# EAGLE design xr2206 - FGG6 (EAGLE 9.6.0)
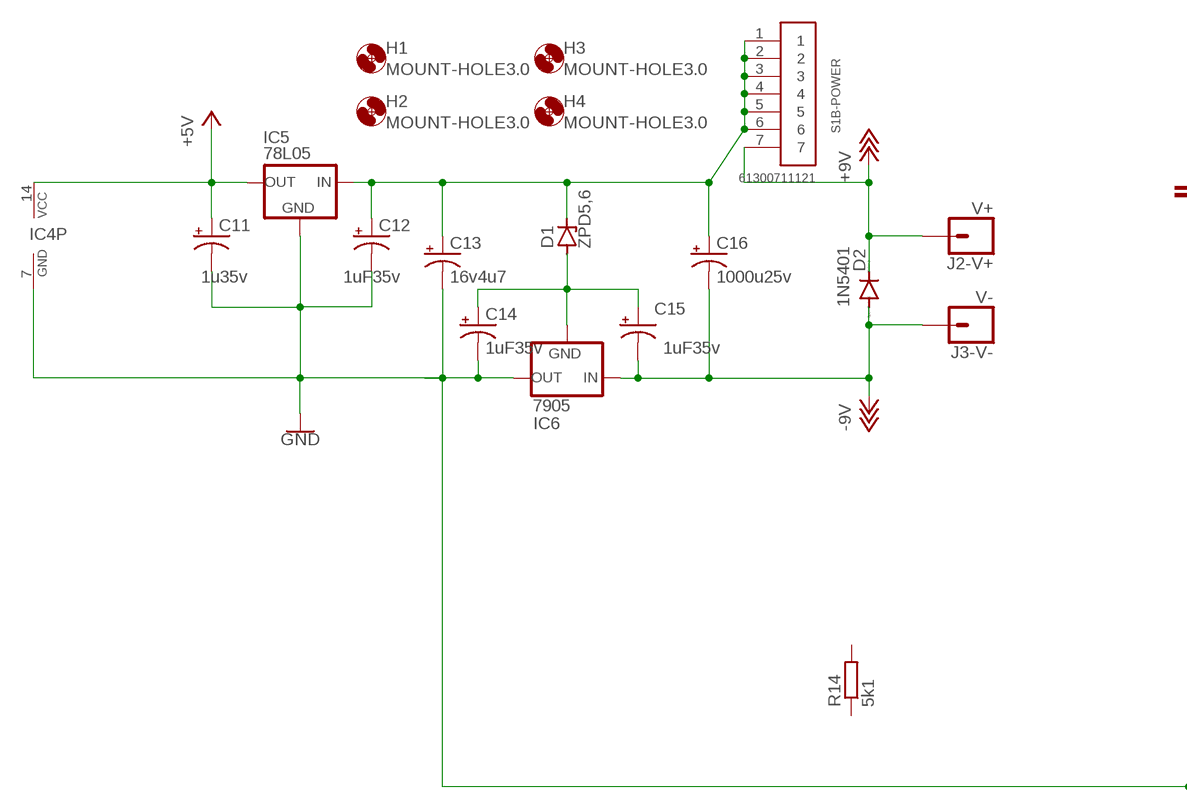
[diagram p0: schematic, sheet 1, part 1 of 2]
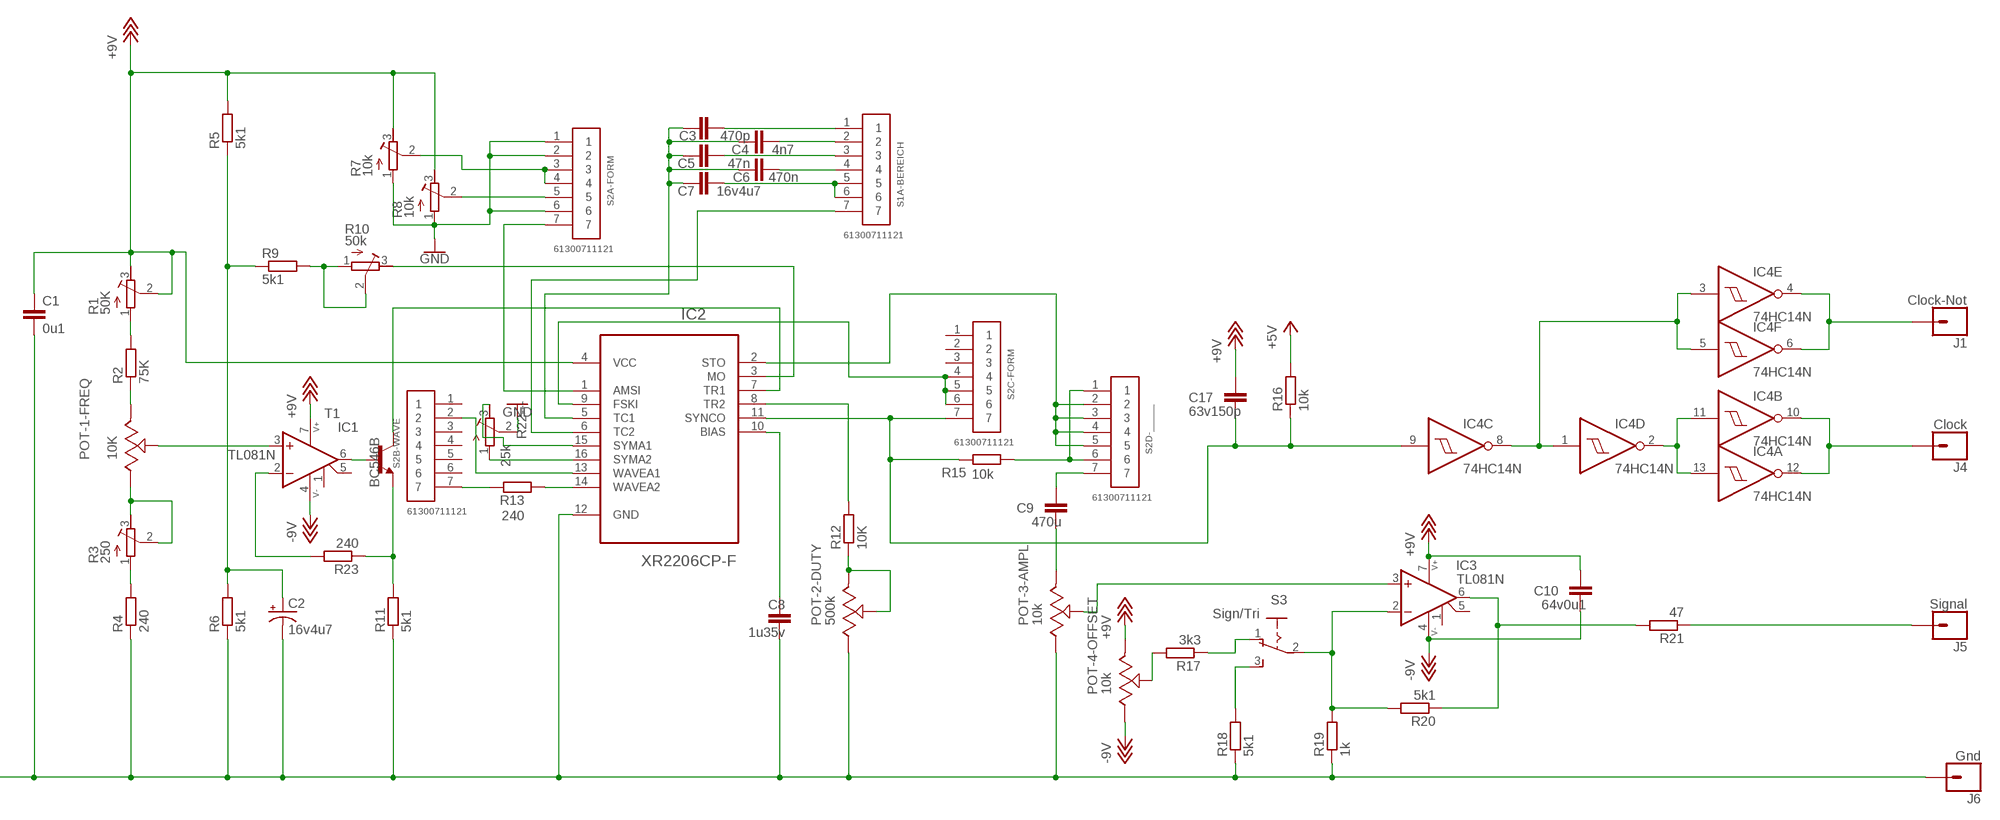
[diagram p1: schematic, sheet 1, part 2 of 2]

## Parts
C1  0u1  10NF-PTH-10MM-10000V-1-%  [CAP-PTH-10MM]
C2  16v4u7  1000UF-RADIAL-5MM-35V-20%-KIT  [CPOL-RADIAL-5MM-10MM-KIT]
C3  470p  10NF-PTH-10MM-10000V-1-%  [CAP-PTH-10MM]
C4  4n7  10NF-PTH-10MM-10000V-1-%  [CAP-PTH-10MM]
C5  47n  10NF-PTH-10MM-10000V-1-%  [CAP-PTH-10MM]
C6  470n  10NF-PTH-10MM-10000V-1-%  [CAP-PTH-10MM]
C7  16v4u7  10NF-PTH-10MM-10000V-1-%  [CAP-PTH-10MM]
C8  1u35v  10NF-PTH-10MM-10000V-1-%  [CAP-PTH-10MM]
C9  470u  10NF-PTH-10MM-10000V-1-%  [CAP-PTH-10MM]
C10  64v0u1  10NF-PTH-10MM-10000V-1-%  [CAP-PTH-10MM]
C11  1u35v  10UF-POLAR-RADIAL-2.5MM-25V-20%  [CPOL-RADIAL-2.5MM-5MM]
C12  1uF35v  10UF-POLAR-RADIAL-2.5MM-25V-20%  [CPOL-RADIAL-2.5MM-5MM]
C13  16v4u7  10UF-POLAR-RADIAL-2.5MM-25V-20%  [CPOL-RADIAL-2.5MM-5MM]
C14  1uF35v  10UF-POLAR-RADIAL-2.5MM-25V-20%  [CPOL-RADIAL-2.5MM-5MM]
C15  1uF35v  10UF-POLAR-RADIAL-2.5MM-25V-20%  [CPOL-RADIAL-2.5MM-5MM]
C16  1000u25v  1000UF-RADIAL-5MM-35V-20%-KIT  [CPOL-RADIAL-5MM-10MM-KIT]
C17  63v150p  10NF-PTH-10MM-10000V-1-%  [CAP-PTH-10MM]
D1  ZPD5,6  1N5333  [C1702-15]
D2  1N5401  1N5400  [DO201-15]
H1  MOUNT-HOLE3.0  [3,0]
H2  MOUNT-HOLE3.0  [3,0]
H3  MOUNT-HOLE3.0  [3,0]
H4  MOUNT-HOLE3.0  [3,0]
IC1  TL081N  [DIL08]
IC2  XR2206CP-F  [DIP254P762X533-16]
IC3  TL081N  [DIL08]
IC4  74HC14N  [DIL14]
IC5  78L05  78XXL  [78XXL]
IC6  7905  79XXL  [79XXL]
J1  Clock-Not  CONN_01  [1X01]
J2-V+  V+  CONN_01  [1X01]
J3-V-  V-  CONN_01  [1X01]
J4  Clock  CONN_01  [1X01]
J5  Signal  CONN_01  [1X01]
J6  Gnd  CONN_01  [1X01]
POT-1-FREQ  10K  3310C-001-503L  [3310C-001-503L]
POT-2-DUTY  500k  3310C-001-503L  [3310C-001-503L]
POT-3-AMPL  10k  3310C-001-503L  [3310C-001-503L]
POT-4-OFFSET  10k  3310C-001-503L  [3310C-001-503L]
R1  50K  R-TRIMM64W  [RTRIM64W]
R2  75K  R-EU_0207/12  [0207/12]
R3  250  R-TRIMM64W  [RTRIM64W]
R4  240  R-EU_0207/7  [0207/7]
R5  5k1  R-EU_0207/7  [0207/7]
R6  5k1  R-EU_0207/7  [0207/7]
R7  10k  R-TRIMM64W  [RTRIM64W]
R8  10k  R-TRIMM64W  [RTRIM64W]
R9  5k1  R-EU_0207/12  [0207/12]
R10  50k  R-TRIMM64W  [RTRIM64W]
R11  5k1  R-EU_0207/7  [0207/7]
R12  10K  R-EU_0207/12  [0207/12]
R13  240  R-EU_0207/7  [0207/7]
R14  5k1  R-EU_0207/7  [0207/7]
R15  10k  R-EU_0207/7  [0207/7]
R16  10k  R-EU_0207/7  [0207/7]
R17  3k3  R-EU_0207/12  [0207/12]
R18  5k1  R-EU_0207/7  [0207/7]
R19  1k  R-EU_0207/7  [0207/7]
R20  5k1  R-EU_0207/7  [0207/7]
R21  47  R-EU_0207/7  [0207/7]
R22---  25k  R-TRIMM64W  [RTRIM64W]
R23  240  R-EU_0207/12  [0207/12]
S1A-BEREICH  61300711121  [61300711121]
S1B-POWER  61300711121  [61300711121]
S2A-FORM  61300711121  [61300711121]
S2B-WAVE  61300711121  [61300711121]
S2C-FORM  61300711121  [61300711121]
S2D-_____  61300711121  [61300711121]
S3  Sign/Tri  255SB  [255SB]
T1  BC546B  [TO92-EBC]

## Nets
+5V: C11.1(+) IC4.14(P:VCC) IC5.OUT R16.2
+18V: C1.1 C10.2 C17.2 D2.C IC1.7(P:V+) IC2.4(VCC) IC3.7(P:V+) J2-V+.1 POT-4-OFFSET.1 R1.2(S) R1.3(E) R5.2 R7.3(E) R8.3(E) S1B-POWER.7 ; supply symbol labelled +9V
-18V: C10.1 C15.2(-) C16.- D2.A IC1.4(P:V-) IC3.4(P:V-) IC6.IN J3-V-.1 POT-4-OFFSET.3 ; supply symbol labelled -9V
GND: C1.2 C2.- C8.1 C11.2(-) C12.2(-) C13.2(-) C14.2(-) IC2.12(GND) IC4.7(P:GND) IC5.GND IC6.OUT J6.1 POT-2-DUTY.3 POT-3-AMPL.3 R4.1 R6.1 R7.1(A) R8.1(A) R11.1 R18.1 R19.1 R22---.2(S) S2A-FORM.1 S2A-FORM.2 S2A-FORM.6
N$1: R3.1(A) R4.2
N$2: POT-1-FREQ.3 R3.2(S) R3.3(E)
N$3: POT-1-FREQ.1 R2.1
N$4: R1.1(A) R2.2
N$5: C12.1(+) C13.1(+) C16.+ D1.C IC5.IN S1B-POWER.1 S1B-POWER.2 S1B-POWER.3 S1B-POWER.4 S1B-POWER.5 S1B-POWER.6
N$6: C14.1(+) C15.1(+) D1.A IC6.GND
N$7: IC1.3(A:+IN) POT-1-FREQ.2
N$8: IC1.6(A:OUT) T1.B
N$9: IC1.2(A:-IN) R23.2
N$10: R11.2 R23.1 T1.E
N$11: IC2.7(TR1) T1.C
N$12: C2.+ R5.1 R6.2 R9.1
N$13: R9.2 R10.1(A) R10.2(S)
N$14: IC2.3(MO) R10.3(E)
N$15: IC2.8(TR2) R12.2
N$16: POT-2-DUTY.1 POT-2-DUTY.2 R12.1
N$17: IC2.1(AMSI) S2A-FORM.7
N$18: R8.2(S) S2A-FORM.5
N$19: R7.2(S) S2A-FORM.3 S2A-FORM.4
N$20: IC2.13(WAVEA1) S2B-WAVE.2
N$21: R13.2 S2B-WAVE.7
N$22: IC2.14(WAVEA2) R13.1
N$23: IC2.6(TC2) S1A-BEREICH.7
N$24: C3.1 C4.1 C5.1 C6.1 C7.1 IC2.5(TC1)
N$25: C3.2 S1A-BEREICH.1
N$26: C4.2 S1A-BEREICH.2
N$27: C6.2 S1A-BEREICH.4
N$28: C5.2 S1A-BEREICH.3
N$29: C7.2 S1A-BEREICH.5 S1A-BEREICH.6
N$30: C8.2 IC2.10(BIAS)
N$31: IC2.9(FSKI) S2C-FORM.4 S2C-FORM.5 S2C-FORM.6
N$32: C17.1 IC2.11(SYNCO) IC4.9(C:I) R15.2 R16.1 S2C-FORM.7
N$33: IC2.2(STO) S2D-_____.2 S2D-_____.3 S2D-_____.4 S2D-_____.5
N$34: IC4.1(D:I) IC4.3(E:I) IC4.5(F:I) IC4.8(C:O)
N$35: IC4.2(D:O) IC4.11(B:I) IC4.13(A:I)
N$36: IC4.10(B:O) IC4.12(A:O) J4.1
N$37: R15.1 S2D-_____.1 S2D-_____.6
N$38: IC3.3(A:+IN) POT-3-AMPL.2
N$39: IC4.4(E:O) IC4.6(F:O) J1.1
N$40: C9.2 S2D-_____.7
N$41: C9.1 POT-3-AMPL.1
N$42: POT-4-OFFSET.2 R17.2
N$43: R17.1 S3.1(O)
N$44: IC3.2(A:-IN) R19.2 R20.2 S3.2(P)
N$45: R18.2 S3.3(S)
N$46: IC3.6(A:OUT) R20.1 R21.2
N$47: J5.1 R21.1
N$48: IC2.16(SYMA2) R22---.1(A)
N$49: IC2.15(SYMA1) R22---.3(E)
Unconnected: IC1.1(-NULL:NULL1) IC1.5(-NULL:NULL2) IC3.1(-NULL:NULL1) IC3.5(-NULL:NULL2) R14.1 R14.2 S2B-WAVE.1 S2B-WAVE.3 S2B-WAVE.4 S2B-WAVE.5 S2B-WAVE.6 S2C-FORM.1 S2C-FORM.2 S2C-FORM.3

## Library data of the parts
C1 C3-C10 C17 = SparkFun-Capacitors:10NF: 0.01uF/10nF/10,000pF ceramic capacitors A capacitor is a passive two-terminal electrical component used to store electrical energy temporarily in an electric field. CAP-09321; PROD_ID: CAP-09321; VALUE: 10nF
C2 C16 = SparkFun-Capacitors:1000UF: 1,000µF/1mF ceramic capacitors A capacitor is a passive two-terminal electrical component used to store electrical energy temporarily in an electric field. CAP-08070; PROD_ID: CAP-09538; VALUE: 1mf
C11-C15 = SparkFun-Capacitors:10UF-POLAR: 10.0µF polarized capacitors A capacitor is a passive two-terminal electrical component used to store electrical energy temporarily in an electric field.; PROD_ID: CAP-08440; VALUE: 10uF
D1 = diode:1N5333: Z DIODE 3.3 V, 5W, 5 percent (Motorola)
D2 = diode:1N5400: DIODE standard rectifier, 3 A, 50 V (Motorola)
H1-H4 = holes:MOUNT-HOLE: MOUNTING HOLE with drill center marker
IC1 IC3 = op-amp:TL081: JFET OP-AMP
IC2 = XR2206CP-F:XR2206CP-F: Monolithic Function Generator; AVAILABILITY: Unavailable; DESCRIPTION: IC FUNCTION GENERATOR 16DIP; MF: MaxLinear, Inc.; MP: XR2206CP-F; PACKAGE: PDIP-16 Exar; PRICE: None
IC4 = 74xx-eu:74*14: Hex schmitt trigger INVERTER
IC5 = v-reg:78XXL: VOLTAGE REGULATOR
IC6 = v-reg:79XXL: VOLTAGE REGULATOR
J1 J2-V+ J3-V- J4-J6 = SparkFun-Connectors:CONN_01: Single connection point. Often used as Generic Header-pin footprint for 0.1 inch spaced/style header connections On any of the 0.1 inch spaced packages, you can populate with these: Break Away Headers - Straight <https://www.sparkfun.com/products/116> (PRT-00116) Break Away Male Headers - Right Angle <https://www.sparkfun.com/products/553> (PRT-00553) Female Headers <https://www.sparkfun.com/products/115> (PRT-00115) Break Away Headers - Machine Pin <https://www.sparkfun.com/products/117> (PRT-00117) Break Away Female Headers - Swiss Machine Pin <https://www.sparkfun.com/products/743> (PRT-00743) This device is also useful as a general connection point to wire up your design to another part of your project. Our various solder wires solder well into these plated through hole pads. Hook-Up Wire - Assortment (Stranded, 22 AWG) <https://www.sparkfun.com/products/11375> (PRT-11375) Hook-Up Wire - Assortment (Solid Core, 22 AWG) <https://www.sparkfun.com/products/11367> (PRT-11367) View the entire wire category on our website here <https://www.sparkfun.com/categories/141> Special notes: SMTSO-256-ET is a "flush mount" nut for a 4-40 screw. We mostly use this on specialty testbeds; it is a nice way to connect hardware to your PCB at an adjustable hieght. Also note, the SNAP packages are for using a snappable style connector. We sell a baggie of snaps and they are also used on two LilyPad designs: Snap Assortment - 30 pack (male and female) <https://www.sparkfun.com/products/11347> (DEV-11347) LilyPad Arduino SimpleSnap <https://www.sparkfun.com/products/10941> (DEV-10941) LilyPad SimpleSnap Protoboard <https://www.sparkfun.com/products/10940> (DEV-10940)
POT-1-FREQ POT-2-DUTY POT-3-AMPL POT-4-OFFSET = Potentiometer_Trimmers:3310C-001-503L: POT 50K OHM 1/4W PLASTIC LINEAR Manufacturer's datasheet <https://www.bourns.com/docs/Product-Datasheets/3310.pdf>; CREATED_BY: PCBLayout.com; DIGIKEY_PARTNO: 3310C-001-503L-ND; MANUFACTURER: Bourns Inc.; MPN: 3310C-001-503L
R1 R3 R7 R8 R10 R22--- = rcl:R-TRIMM: Trimm resistor; SPICEMODEL: X; SPICEPREFIXL: POT
R2 R4-R6 R9 R11-R21 R23 = rcl:R-EU_: RESISTOR, European symbol; SPICEPREFIX: R
S1A-BEREICH S1B-POWER S2A-FORM S2B-WAVE S2C-FORM S2D-_____ = Headers:61300711121: CONN HEADER VERT 7POS 2.54MM Manufacturer's datasheet <https://katalog.we-online.de/em/datasheet/6130xx11121.pdf>; CREATED_BY: PCBLayout.com; DIGI_KEY_PART_NUMBER: 732-5320-ND; MANUFACTURER: Wurth Electronics Inc.; MPN: 61300711121
S3 = switch:255SB: SLIDING SWITCH Distributor Buerklin, 11G810
T1 = transistor-npn:BC546*: NPN Transistor

## Net classes
0 default: width 0.508 mm, clearance 0.254 mm
1 -5V: width 0.508 mm, clearance 0.254 mm

## Board
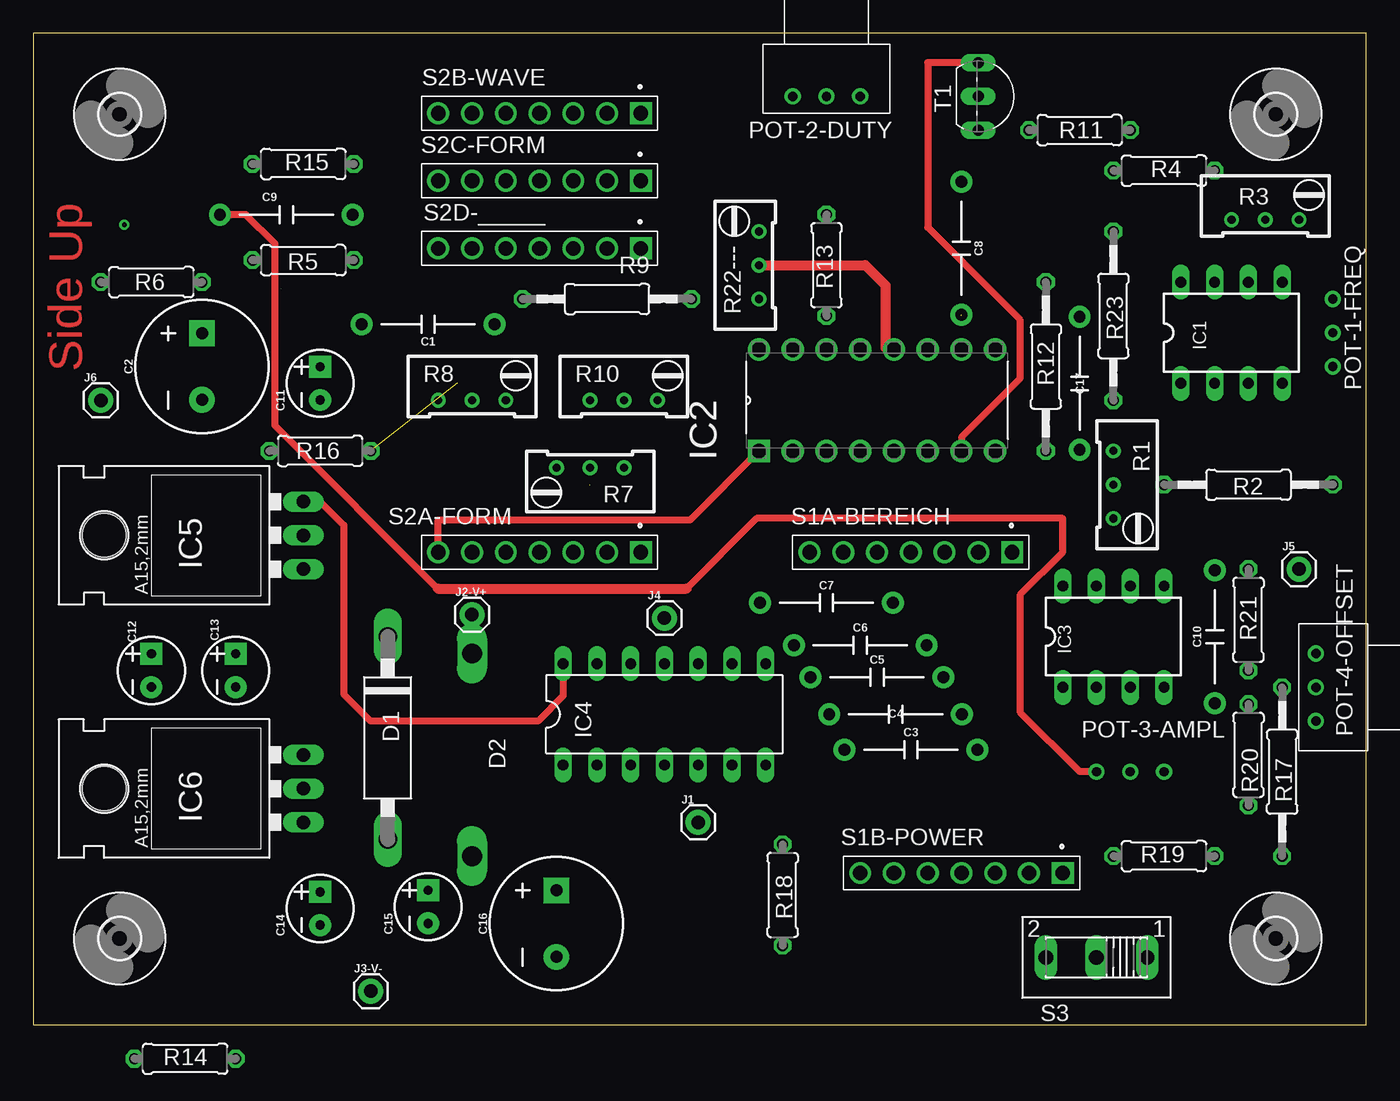
[diagram p2: board, top side]
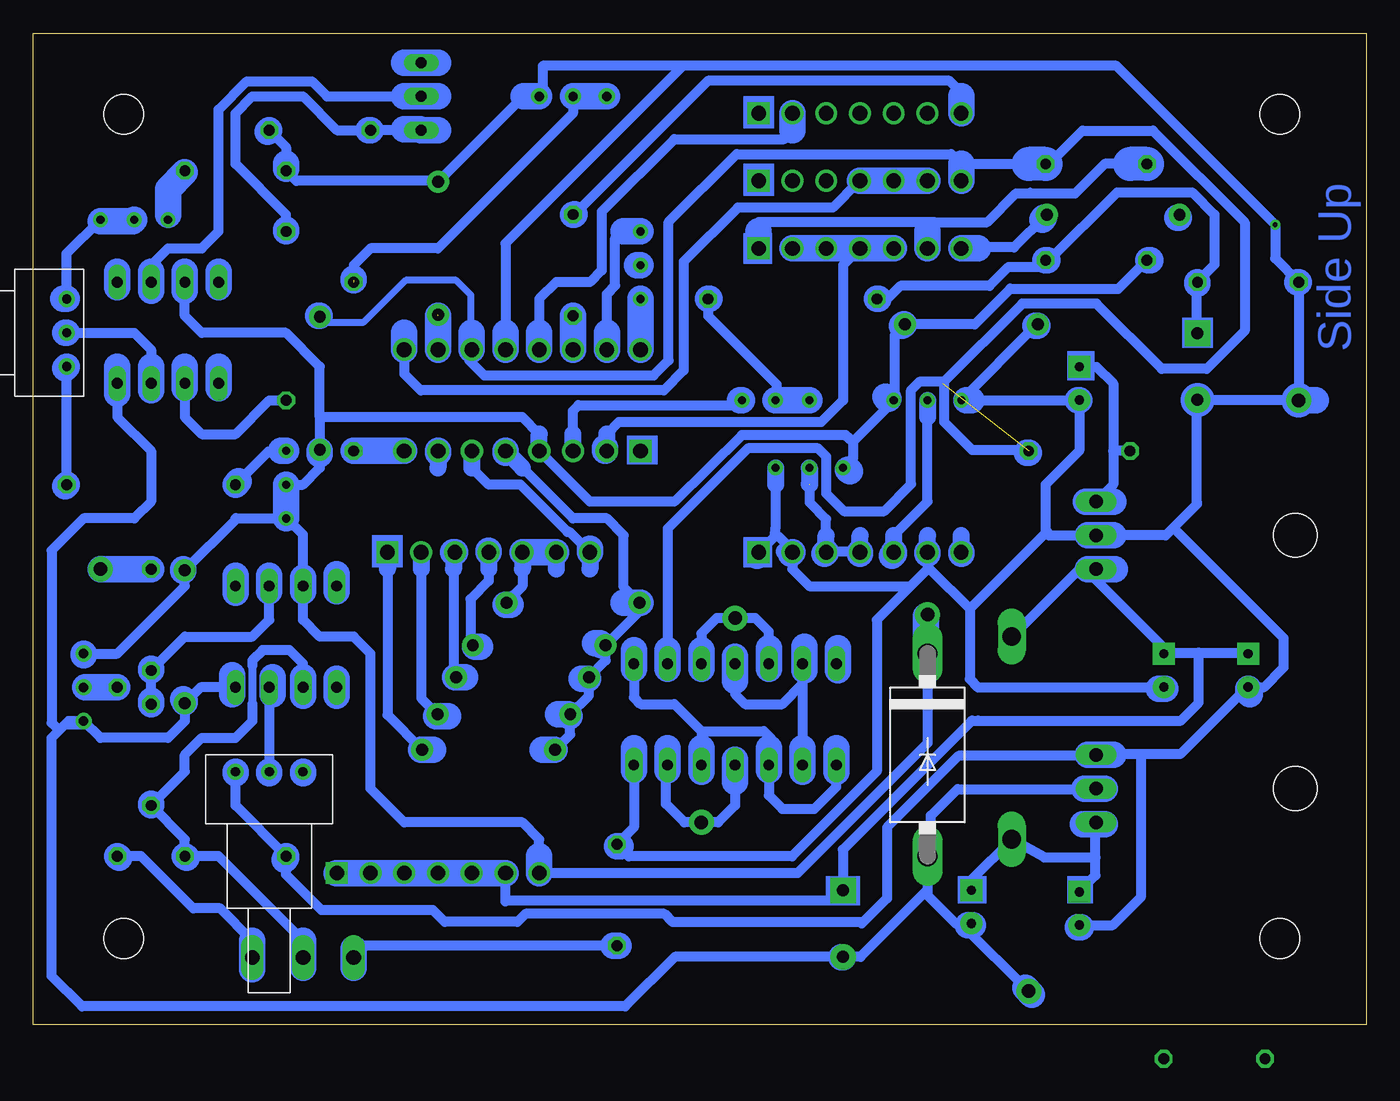
[diagram p3: board, bottom side, seen from below]

Size 100.31 x 74.6 mm. Coordinates in mm from the lower left corner, seen from the top.
Outline: 0,0 100.31,0 100.31,74.6 0,74.6 0,0
Copper layers (1*16): Top 0.035mm / dielectric 1.5mm / Bottom 0.035mm
Design rules "xr2206 - FGG6": minimum track width 6mil, minimum drill 0.35mm, track to track 0.205mm, track to pad 0.205mm, pad to pad 0.205mm, via to via 0.205mm, smd to smd 6mil, copper to edge 40mil, drill to drill 6mil, minimum pad ring 10mil, minimum via ring 8mil, stop-mask expansion 4mil, vias tented up to drill 0mil, thermal gap 10mil

### Footprints (pad centres in the part's own frame; a part is rotated, then mirrored left to right if it is on the bottom)
CAP-PTH-10MM = drill 0.9 pad 1.651: 1 -5,0; 2 5,0
CPOL-RADIAL-5MM-10MM-KIT = drill 0.9 pad 1.93 square: + 2.5,0 | drill 0.9 pad 1.93: - -2.5,0
CPOL-RADIAL-2.5MM-5MM = drill 0.7 pad 1.651 square: 1 1.25,0 | drill 0.7 pad 1.651: 2 -1.25,0
C1702-15 = drill 1.397 long: A 7.62,0; C -7.62,0
DO201-15 = drill 1.499 long: A 7.62,0; C -7.62,0
3,0 = hole 3: 0,0
DIL08 = drill 0.813 long: 1 -3.81,-3.81; 2 -1.27,-3.81; 3 1.27,-3.81; 4 3.81,-3.81; 5 3.81,3.81; 6 1.27,3.81; 7 -1.27,3.81; 8 -3.81,3.81
DIP254P762X533-16 = drill 1.118 square: 1 -7.62,17.78 | drill 1.118: 2 -7.62,15.24; 3 -7.62,12.7; 4 -7.62,10.16; 5 -7.62,7.62; 6 -7.62,5.08; 7 -7.62,2.54; 8 -7.62,0; 9 0,0; 10 0,2.54; 11 0,5.08; 12 0,7.62; 13 0,10.16; 14 0,12.7; 15 0,15.24; 16 0,17.78
DIL14 = drill 0.813 long: 1 -7.62,-3.81; 2 -5.08,-3.81; 3 -2.54,-3.81; 4 0,-3.81; 5 2.54,-3.81; 6 5.08,-3.81; 7 7.62,-3.81; 8 7.62,3.81; 9 5.08,3.81; 10 2.54,3.81; 11 0,3.81; 12 -2.54,3.81; 13 -5.08,3.81; 14 -7.62,3.81
78XXL = drill 1.016 long: GND 0,-3.81; IN -2.54,-3.81; OUT 2.54,-3.81 | hole 3.302: 0,11.176
79XXL = drill 1.016 long: GND -2.54,-3.81; IN 0,-3.81; OUT 2.54,-3.81 | hole 3.302: 0,11.176
1X01 = drill 1.016 pad 1.88: 1 0,0
3310C-001-503L = drill 0.71: 1 2.54,0; 2 0,0; 3 -2.54,0
RTRIM64W = drill 0.61: 1 1.27,-2.54; 2 1.27,0; 3 1.27,2.54
0207/12 = drill 0.813 octagon: 1 -6.35,0; 2 6.35,0
0207/7 = drill 0.813 octagon: 1 -3.81,0; 2 3.81,0
61300711121 = drill 1.1 square: 1 -7.62,0 | drill 1.1: 2 -5.08,0; 3 -2.54,0; 4 0,0; 5 2.54,0; 6 5.08,0; 7 7.62,0
255SB = drill 1.118 long: 1 -3.81,0; 2 0,0; 3 3.81,0
TO92-EBC = drill 0.813 long: B 0,-1.27; C -2.54,-1.27; E 2.54,-1.27

### Placement (x,y rotation side)
C1  29.72,52.7 180 top
C2  12.7,49.53 90 top
C3  66.04,20.7 0 top
C4  64.9,23.37 0 top
C5  63.5,26.16 0 top
C6  62.23,28.57 0 top
C7  59.69,31.75 0 top
C8  69.85,58.42 270 top
C9  19.05,60.96 0 top
C10  88.9,29.21 90 top
C11  21.59,48.26 90 top
C12  8.89,26.67 90 top
C13  15.24,26.67 90 top
C14  21.59,8.76 90 top
C15  29.72,8.89 90 top
C16  39.37,7.62 90 top
C17  78.74,48.26 270 top
D1  26.67,21.59 270 top
D2  33.02,20.32 270 bottom
H1  93.5,68.5 0 top
H2  93.5,6.5 0 top
H3  6.5,6.5 180 top
H4  6.5,68.5 0 top
IC1  90.17,52.07 0 top
IC2  72.39,50.8 90 top
IC3  81.28,29.21 0 top
IC4  47.5,23.37 0 top
IC5  16.51,36.83 90 top
IC6  16.51,17.78 90 top
J1  50.04,15.24 0 top
J2-V+  33.02,30.86 0 top
J3-V-  25.4,2.54 0 top
J4  47.5,30.61 0 top
J5  95.25,34.29 0 top
J6  5.08,46.99 0 top
POT-1-FREQ  97.79,52.07 270 bottom
POT-2-DUTY  59.69,69.85 180 top
POT-3-AMPL  82.55,19.05 0 bottom
POT-4-OFFSET  96.52,25.4 90 top
R1  82.55,40.64 180 top
R2  91.44,40.64 180 top
R3  92.71,61.85 270 top
R4  85.09,64.26 0 top
R5  20.32,57.53 180 top
R6  8.89,55.88 0 top
R7  41.91,40.64 90 top
R8  33.02,48.26 270 top
R9  43.18,54.61 0 top
R10  44.45,48.26 270 top
R11  78.74,67.31 180 top
R12  76.2,49.53 270 top
R13  59.69,57.15 90 top
R14  11.43,-2.54 0 top
R15  20.32,64.77 0 top
R16  21.59,43.18 180 top
R17  93.98,19.05 90 top
R18  56.39,9.78 270 top
R19  85.09,12.7 0 top
R20  91.44,20.32 270 top
R21  91.44,30.48 270 top
R22---  53.34,57.15 0 top
R23  81.28,53.34 270 top
S1A-BEREICH  66.04,35.56 180 top
S1B-POWER  69.85,11.43 180 top
S2A-FORM  38.1,35.56 180 top
S2B-WAVE  38.1,68.58 180 top
S2C-FORM  38.1,63.5 180 top
S2D-_____  38.1,58.42 180 top
S3  80.01,5.08 180 top
T1  72.39,69.85 270 top

### Tracks (layer width: path | path; a pad name or v marks a point on that pad's centre or on a via)
+5V
  Top 0.508: IC4.14 39.88,24.77 37.97,22.86 25.4,22.86 23.37,24.89 23.37,37.59 21.59,39.37 IC5.OUT
  Bottom 0.75: C11.1 20.3,49.51 19.05,48.26 19.05,43.18 | 19.05,43.18 19.05,40.64 IC5.OUT | R16.2 19.05,43.18
+18V  (1 unrouted)
  Bottom 0.508: 16.49,57.63 R5.2 16.53,57.51 16.52,57.51 | 35.5,47 R8.3 35.62,46.75 | 34.75,52.62 C1.1 | 78.75,43.38 C17.2 | 81.25,38.12 R1.3 81.25,37.88 | 81.25,40.62 R1.2 81.15,40.77 | 62.36,11.88 S1B-POWER.7 62,11.5 | D2.C 33.12,27.88 33.12,30.76 J2-V+.1 | 38.62,43.65 38.62,43.88
  Bottom 0.75: 34.75,52.62 35.5,51.88 35.5,47 38.62,43.88 39.18,44.38 46.99,44.38 52.07,39.37 58.42,39.37 IC2.4 | 18.65,55.38 26.79,55.38 29.46,52.7 C1.1 | 38.62,43.65 38.62,42.66 R7.3 | D2.C 33.02,27.69 33.02,21.21 42.8,11.43 S1B-POWER.7 | 62.23,12.7 62.23,13.97 63.5,15.24 72.39,15.24 74.93,17.78 74.93,27.94 76.2,29.21 78.74,29.21 80.01,30.48 80.01,32.64 IC3.7 80.01,33.66 80.01,36.88 81.25,38.12 85.06,38.12 85.09,38.1 85.09,38.02 C10.2 88.9,33.02 93.98,27.94 POT-4-OFFSET.1 | R1.3 81.25,38.13 81.25,40.62 | R1.2 80.01,40.64 78.74,41.91 78.74,42.93 | 78.74,43.18 C17.2 | 62.23,44.45 63.5,45.72 78.74,45.72 | 78.74,45.72 78.75,45.71 78.75,43.38 | 78.74,45.72 78.74,49.53 81.28,52.07 87.63,52.07 88.9,53.34 88.9,55.24 IC1.7 | 18.67,55.37 R5.2
  Bottom 1.27: IC2.4 62.23,44.45
  Bottom 2: S1B-POWER.7 62.23,12.7 | 80.01,33.66 80.01,32.64 | POT-4-OFFSET.1 96.52,27.81 | 78.74,43.18 78.74,42.93 | R1.2 R1.3 | 88.9,56.64 88.9,55.24 | 33.15,30.73 33.15,27.81 33.02,27.69
-18V
  Bottom 0.508: 96.73,23 POT-4-OFFSET.3 96.61,22.62 | 20.38,17.75 IC6.IN | 33,12.75 D2.A 33.12,11.25 | C15.2 30.11,7.25 | 39.25,5.12 C16.- 39.5,5
  Bottom 0.75: C15.2 30.91,7.64 33.02,9.75 33.02,10.16 | J3-V-.1 25.65,2.79 30.11,7.25 | 33.02,10.16 33.02,11.68 D2.A 32.77,12.95 32.77,15.75 30.76,17.75 20.38,17.75 | 33.02,10.16 38.05,5.12 39.25,5.12 | C16.- 52.03,5.12 55.76,1.39 96.64,1.39 98.92,3.67 98.92,21.59 98.36,22.15 | 98.36,22.15 97.88,22.62 96.61,22.62 | IC3.4 87.71,25.4 C10.1 88.9,22.86 90.17,21.59 95.25,21.59 POT-4-OFFSET.3 97.65,22.86 | IC1.4 93.98,47.5 93.98,45.72 91.44,43.18 91.44,39.37 92.71,38.1 96.52,38.1 98.92,35.7 98.92,22.72 98.36,22.15
  Bottom 2: 93.98,49.53 93.98,47.5 | 33.02,13.84 33.02,11.68 | 25.15,2.29 25.65,2.79
GND  (via drill 0.35)  (1 unrouted)
  Top 0.75: IC2.12 64.26,50.8 64.14,50.93 64.14,55.63 62.61,57.15 R22---.2
  Bottom 0.508: 45.62,35.62 S2A-FORM.1 45.88,35.38 | 44.25,36.75 44.5,36.75 | 43.25,35.75 S2A-FORM.2 | 30.38,47 R8.1 30.43,46.99 C1.2 | 24.03,37.11 24.09,37.05 | 24.77,52.58 24.64,52.58 | 20.25,20.38 IC6.OUT 20.5,20.25 | 9,25.38 C12.2 | 15.21,36.84 12.75,39.3 12.75,39.18 | 15.1,36.83 14.39,37.28 | 85,19 POT-3-AMPL.3 | R19.1 81.28,12.65 | 5.12,47 J6.1 | 12.68,47.01 12.67,47 12.75,46.92 | C11.2 21.61,46.99 | 56.39,13.08 56.39,13.46 R18.1 | 24.13,37.08 24.09,37.05 | 24.09,37.05 23.88,36.83 | 15.32,25.5 C13.2
  Bottom 0.75: 44.45,40.64 44.45,37.41 44.5,36.75 45.62,35.62 | 43.25,35.75 44.25,36.75 | 34.29,33.02 33.02,34.29 | R8.1 24.89,52.58 | 16.98,20.38 14,20.38 9,25.38 | 16.98,20.38 20.25,20.38 | C14.2 19.07,7.51 16.98,9.61 16.98,20.38 | C12.2 7.68,25.42 6.23,26.88 6.23,29.12 14.39,37.28 | 12.75,39.18 15.1,36.83 19.05,36.83 IC5.GND 20.95,36.83 23.88,36.83 | 5.1,47 12.67,47 | 51.43,72.14 18.8,72.14 v6.85,60.2 | v6.86,60.2 6.86,57.66 R6.1 J6.1 | 30.43,46.99 30.1,46.99 | 29.72,46.99 21.72,46.99 21.61,46.99 | C11.2 21.59,46.99 21.59,43.18 24.13,40.64 24.13,37.08 | 12.75,39.3 12.75,46.92 | S2A-FORM.2 43.18,34.29 41.91,33.02 34.29,33.02 | 33.02,35.43 33.02,34.29 | 33.02,34.29 32.84,34.29 29.84,31.3 | 24.03,37.11 29.84,31.3 | 29.84,31.3 29.84,26.04 29.21,25.4 15.42,25.4 15.32,25.5 | 37.86,7.74 36.07,9.53 36.07,14.86 30.68,20.25 20.5,20.25 | 37.86,7.74 37.97,7.62 | 81.28,12.57 81.28,11.3 78.61,8.64 70.23,8.64 69.34,7.75 63.88,7.75 63.27,8.36 52.81,8.36 52.19,7.74 37.86,7.74 | R19.1 85.09,16.51 85.09,18.91 85,19 | 34.29,33.02 36.83,30.48 36.83,19.07 43.22,12.69 55.49,12.69 R18.1 55.12,14.86 55.12,19.18 IC4.7 | 63.42,69.85 C8.1 69.93,63.5 80.52,63.5 R4.1 81.28,66.04 R11.1 | 64.77,52.07 64.77,58.8 51.43,72.14 | 51.43,72.14 61.98,72.14 61.98,70.1 POT-2-DUTY.3
  Bottom 1.27: R7.1 44.45,40.64 | S2A-FORM.6 33.02,36.83 | S2A-FORM.2 43.75,35.56 43.81,35.62
  Bottom 2: IC2.12 64.77,52.07 | R22---.2 54.89,57.15 | POT-2-DUTY.3 63.42,69.85 | 55.12,20.83 55.12,19.18 | POT-3-AMPL.3 85.09,18.92 | R19.1 81.28,12.57 81.41,12.45 | R11.1 82.68,67.18 | 56.39,13.46 56.13,13.46 | S2A-FORM.6 33.02,35.43 | S2A-FORM.2 43.31,35.43 | S2A-FORM.1 45.85,35.43 45.85,35.31 | 21.59,46.99 21.72,46.99 | 24.77,52.58 24.89,52.58 | 29.72,46.99 30.1,46.99 | R6.1 5.21,55.88 | 19.05,36.83 20.95,36.83 | J6.1 3.81,46.99
  Bottom 2.54: C2.- 12.68,47.01 | J6.1 5.1,47
N$1
  Bottom 0.75: R4.2 90.17,62.99 90.17,60.96 R3.1
  Bottom 2: 90.17,60.96 90.17,62.87 88.9,64.14
N$2
  Bottom 0.75: POT-1-FREQ.3 97.79,58.04 R3.3 R3.2
  Bottom 2: POT-1-FREQ.3 98.04,54.61 | 95.25,60.45 92.84,60.45 R3.2
N$3
  Bottom 0.508: 97.79,40.26 97.73,40.2 97.73,40.58 R2.1
  Bottom 0.75: R2.1 POT-1-FREQ.1
  Bottom 2: 97.92,40.51 R2.1 | POT-1-FREQ.1 97.92,49.4
N$4
  Bottom 0.508: 81.38,43.12 R1.1 | 85,40.75 R2.2
  Bottom 0.75: 81.38,43.12 82.62,43.12 85,40.75
  Bottom 2: R1.1 81.66,43.18 | R2.2 84.84,40.89
N$5
  Bottom 0.508: 9,28 C12.1 | 15.12,28 C13.1 15.12,28.25 | 21.62,34.25 20.38,34.25 IC5.IN 20.88,34 | 26.62,29.25 D1.C | 64.88,11.5 S1B-POWER.6 | 39.4,9.37 39.38,9.87 C16.+ | 64.65,9.37 64.77,9.27
  Bottom 0.75: 15.12,28 12.61,28 | 12.61,28 9,28 | 26.62,29.25 21.62,34.25 | 20.88,34 15.12,28.25 | 64.65,9.37 39.4,9.37 | 64.77,9.27 S1B-POWER.6 S1B-POWER.5 S1B-POWER.4 S1B-POWER.3 S1B-POWER.2 S1B-POWER.1 | 12.61,28 12.61,24.24 13.95,22.89 29.21,22.89 | 29.64,22.89 29.21,22.89 | 29.21,22.89 29.25,22.86 29.72,22.86 39.38,13.2 39.38,9.87
  Bottom 2: S1B-POWER.6 S1B-POWER.1
N$6
  Bottom 0.508: 20.38,15.12 IC6.GND | 21.5,10.12 C14.1 | 26.75,13.88 D1.A
  Bottom 0.75: 20.38,12.61 20.38,11.25 21.5,10.12 | 20.38,12.61 20.38,15.12 | 26.75,13.88 29.62,11 29.62,10.25 C15.1 | 20.38,12.61 24.23,12.61 D1.A
N$7
  Bottom 0.508: 97.68,51.87 POT-1-FREQ.2
  Bottom 0.75: POT-1-FREQ.2 92.71,52.07 91.44,50.8 91.44,49.53 IC1.3
  Bottom 2: 91.44,49.53 91.44,47.75 | POT-1-FREQ.2 97.92,52.07
N$8
  Bottom 0.75: IC1.6 91.44,56.64 91.44,57.15 90.17,58.42 87.63,58.42 86.36,59.69 86.36,68.86 84.24,70.98 79.34,70.98 78.21,69.85 T1.B
  Bottom 2: 72.39,69.88 71.14,69.88 T1.B 69.85,69.85 | 91.44,56.64 91.44,55.24
N$9
  Bottom 0.508: 81.38,46.88 R23.2
  Bottom 0.75: IC1.2 88.9,47.88 88.9,45.72 87.63,44.45 85.09,44.45 82.55,46.99 81.49,46.99 81.38,46.88
  Bottom 2: 88.9,49.53 88.9,47.88
N$10
  Bottom 0.508: 81.38,59.75 R23.1
  Bottom 0.75: T1.E R11.2 | 81.28,59.82 81.28,60.96 85.09,64.77 85.09,68.58 83.82,69.85 80.01,69.85 77.47,67.31 75.06,67.31
  Bottom 2: 72.39,67.38 71.19,67.38 T1.E 69.85,67.31 | R23.1 81.28,59.82 | R11.2 75.06,67.31
N$11
  Top 0.508: T1.C 67.31,72.39 67.31,60.01 74.24,53.07 74.24,48.59 69.85,44.2 IC2.7
  Bottom 1.27: IC2.7 69.85,41.91
  Bottom 2: 72.39,72.39 T1.C 69.85,72.39 | IC2.7 69.85,43.05
N$12
  Bottom 0.508: 12.75,55.88 R6.2 12.5,56 | 12.75,52.12 C2.+ | 23.87,57.51 R5.1 | 24.4,57.02 24.38,57
  Bottom 0.75: 12.75,52.12 12.75,55.88 11.43,57.2 11.43,60.96 13.1,62.63 18.75,62.63 23.87,57.51 24.38,57 | R9.1 36.24,54.4 35.04,55.6 28.34,55.6 26.92,57.02 24.4,57.02
  Bottom 2: R9.1 36.7,54.61 | 12.7,55.75 R6.2 | R5.1 24,57.53
N$13
  Bottom 0.508: 42,47 R10.1 | 44.38,47 R10.2
  Bottom 0.75: R9.2 49.53,53.34 44.38,48.19 44.38,47
  Bottom 2: R9.2 49.4,54.61 | R10.1 R10.2
N$14
  Bottom 0.508: 47.02,46.62 R10.3
  Bottom 0.75: 47.02,46.62 59.29,46.62 59.69,46.19 59.69,44.45
  Bottom 1.27: IC2.3 59.69,44.45
  Bottom 2: R10.3 47.12,46.99
N$15
  Bottom 0.508: 76.12,43.25 R12.2 | 72.5,43.25 IC2.8
  Bottom 0.75: 72.5,43.25 76.12,43.25
  Bottom 2: IC2.8 R12.2
N$16  (1 unrouted)
  Bottom 0.75: 76.2,56.13 76.2,57.15 74.93,58.42 69.85,58.42 59.69,68.58 POT-2-DUTY.2
  Bottom 2: POT-2-DUTY.1 POT-2-DUTY.2 | 76.2,56.01 76.2,56.13
N$17
  Top 0.508: S2A-FORM.7 30.48,37.97 49.4,37.97 IC2.1
  Bottom 1.27: S2A-FORM.7 30.48,36.83
  Bottom 2: S2A-FORM.7 30.48,35.43
N$18
  Bottom 0.508: S2A-FORM.5
  Bottom 0.75: R8.2 33,46.97 | 35.56,36.83 33.02,39.37 33.02,45.72
  Bottom 1.27: R8.2 33.02,45.72 | S2A-FORM.5 35.56,36.83
  Bottom 2: S2A-FORM.5 35.56,35.43 35.69,35.31
N$19  (1 unrouted)
  Bottom 0.508: 38.12,35.62 S2A-FORM.4 | 40.5,35.62 S2A-FORM.3
  Bottom 0.75: 41.88,40.64 41.88,39.29 40.64,38.05 40.64,36.83 | 40.5,35.62 38.12,35.62
  Bottom 1.27: R7.2 41.91,40.67 41.89,40.66 41.89,40.64 | S2A-FORM.4 38.1,36.83 | S2A-FORM.3 40.64,36.83
  Bottom 2: S2A-FORM.4 38.1,35.43 | S2A-FORM.3 40.77,35.43
N$20
  Bottom 0.75: S2B-WAVE.2 43.18,67.35 43.8,66.64 52.07,66.64 57.53,61.18 57.53,56.77 58.42,55.88 60.96,55.88 62.23,54.61 62.23,52.07
  Bottom 2: S2B-WAVE.2 43.18,67.31 | IC2.13 62.23,52.07
N$21
  Bottom 0.508: 59.56,61 59.62,61
  Bottom 0.75: 30.48,69.85 30.48,70.13 31.37,71.02 49.54,71.02 59.56,61
  Bottom 2: S2B-WAVE.7 30.48,69.85 | R13.2 59.6,60.96 59.56,61
N$22
  Bottom 0.508: 59.75,53.25 R13.1 | 59.75,50.88 IC2.14
  Bottom 2: IC2.14 R13.1
N$23
  Bottom 0.75: S1A-BEREICH.7 59.96,37.1 60.11,37.1 63.65,40.64 66.04,40.64 67.31,41.91
  Bottom 1.27: IC2.6 67.31,41.91 | S1A-BEREICH.7 58.42,34.29
  Bottom 2: S1A-BEREICH.7 58.42,35.81
N$24
  Bottom 0.75: C3.1 59.9,21.84 C4.1 58.5,24.77 C5.1 57.23,27.43 C6.1 54.69,31.11 C7.1 55.88,32.94 55.88,36.83 57.15,38.1 59.69,38.1 63.5,41.91
  Bottom 1.27: IC2.5 63.5,41.91
  Bottom 2: IC2.5 64.77,43.05
N$25
  Bottom 0.75: 73.66,34.29 73.66,23.32 C3.2
  Bottom 1.27: S1A-BEREICH.1 73.66,34.29
N$26
  Bottom 0.75: 71.12,34.29 71.12,24.59 C4.2
  Bottom 1.27: S1A-BEREICH.2 71.12,34.29
N$27
  Bottom 0.508: 67.25,28.62 C6.2
  Bottom 0.75: 66.04,34.29 66.04,33.4 67.42,32.03 67.42,28.79 67.25,28.62
  Bottom 1.27: S1A-BEREICH.4 66.04,34.29
  Bottom 2: S1A-BEREICH.4 66.04,35.69
N$28
  Bottom 0.75: 68.68,34.29 68.68,26.35 C5.2
  Bottom 1.27: S1A-BEREICH.3 68.68,35.46 68.68,34.29
  Bottom 2: S1A-BEREICH.3 68.71,35.56
N$29
  Bottom 0.75: 63.5,34.29 63.5,33.02 64.69,31.83 C7.2
  Bottom 1.27: S1A-BEREICH.5 63.5,34.29 | S1A-BEREICH.6 60.96,34.29
  Bottom 2: S1A-BEREICH.6 S1A-BEREICH.5
N$30  (1 unrouted)
  Bottom 0.508: 69.88,50.88 IC2.10
  Bottom 2: IC2.10 69.85,53.34
N$31
  Bottom 0.508: 38.25,63.38 S2C-FORM.4
  Bottom 0.75: S2C-FORM.6 S2C-FORM.5 S2C-FORM.4 | IC2.9 72.39,48.98 71.15,47.74 52.86,47.74 51.37,49.23 51.37,57.42 47.29,61.49 40.13,61.49 38.25,63.38
  Bottom 2: S2C-FORM.6 S2C-FORM.4 | IC2.9 72.39,52.07
N$32  (1 unrouted)
  Bottom 0.508: 25.5,43.25 R16.1 | 30.27,64.75 30.48,64.54 S2C-FORM.7 30.48,64.76 31.23,65.51 | C17.1 78.35,52.87 75.43,52.87 72.28,56.02 68.49,56.02 67.38,54.91 67.38,50.88 IC2.11 67.31,50.17 67.49,49.98 | 23.88,64.75 R15.2 | IC4.9 52.48,27.28
  Bottom 0.75: 25.5,43.25 29.65,43.25 31.75,45.35 31.75,48.38 33.63,48.38 34.25,47.75 34.25,40.68 36.27,38.66 39.31,38.66 40.63,39.98 40.63,42.76 41.25,43.38 46.53,43.38 52.58,37.33 52.58,28.19 IC4.9 | 25.4,64.75 30.27,64.75 | 31.23,65.51 47.38,65.51 52.49,60.41 52.49,50 53.62,48.87 66.38,48.87 67.49,49.98 | 31.88,48.26 25.88,54.25 20.29,54.25 15.4,49.36 12.01,49.36 9.15,52.22 9.15,60.37 16.04,67.27 21.36,67.27 23.88,64.75
  Bottom 2: S2C-FORM.7 30.48,64.77 | IC2.11 67.31,52.07 | 52.58,28.19 52.58,26.8
  Bottom 2.54: R15.2 25.38,64.77 25.4,64.75
N$33
  Bottom 0.508: S2D-_____.5 35.62,58.5 38,58.5 S2D-_____.4 38.25,58.5 40.62,58.5 S2D-_____.3 | S2D-_____.2 43.12,58.5 40.88,58.5 S2D-_____.3 | S2D-_____.3 40.24,58.02
  Bottom 0.75: S2D-_____.4 39.37,57.15 39.37,46.99 41.02,45.34 56.26,45.34 57.15,44.45
  Bottom 1.27: IC2.2 57.15,44.45
  Bottom 2: S2D-_____.5 S2D-_____.2
N$34
  Bottom 0.75: IC4.8 55.12,26.8 55.12,24.64 54.61,24.13 52.07,24.13 50.04,22.1 | 50.04,22.1 50.04,20.83 IC4.5 | 50.04,22.1 45.34,22.1 44.83,21.59 44.83,19.68 IC4.3 44.96,19.18 44.96,17.27 43.94,16.26 41.53,16.26 39.88,17.91 39.88,19.05 IC4.1
  Bottom 2: 39.88,20.83 39.88,19.05 | 44.96,20.83 44.96,19.18 | 50.04,20.83 50.04,19.05 | 55.12,28.19 55.12,26.8
N$35
  Bottom 0.75: IC4.2 42.42,20.83 IC4.13 42.42,25.65 43.94,24.13 46.74,24.13 47.5,24.89 47.5,25.91 IC4.11
  Bottom 2: 42.42,20.83 42.42,19.05 | 47.5,25.91 47.5,27.69
N$36
  Bottom 0.75: IC4.12 44.96,28.32 44.96,29.59 45.97,30.61 J4.1 48.9,30.61 50.04,29.46 50.04,28.19 IC4.10
  Bottom 2: 50.04,28.19 50.04,26.8 | 44.96,28.32 44.96,26.8
N$37
  Bottom 0.508: 25.46,62.55 25.3,62.72 | 32.53,60.38 32.72,59.62 S2D-_____.6
  Bottom 0.75: 45.72,59.69 45.72,60.38 32.53,60.38 28.52,60.38 26.35,62.55 25.46,62.55 21.91,62.55 19.68,64.77 17.78,64.77
  Bottom 2: S2D-_____.6 33.02,59.69 | S2D-_____.1 45.72,59.69
  Bottom 2.54: R15.1 17.78,64.77
N$38
  Bottom 0.75: IC3.3 POT-3-AMPL.2
  Bottom 2: 82.55,18.92 POT-3-AMPL.2
N$39
  Bottom 0.75: IC4.4 47.5,18.29 47.5,16.51 48.77,15.24 J1.1 51.31,15.24 52.7,16.64 52.7,19.43 IC4.6
  Bottom 2: 47.5,18.29 47.5,19.94
N$40
  Bottom 0.508: 30.38,58.5 S2D-_____.7 | 24.12,60.88 C9.2
  Bottom 0.75: 30.38,58.5 26.5,58.5 24.12,60.88
  Bottom 2: S2D-_____.7 29.21,58.42
N$41
  Top 0.508: POT-3-AMPL.1 78.74,19.05 74.3,23.5 74.3,32.38 77.47,35.56 77.47,38.1 54.44,38.1 49.17,32.83 | C9.1 16,60.96 18.19,58.78 18.19,45.08 30.44,32.83
  Top 0.75: 30.44,32.83 49.17,32.83
  Bottom 2: POT-3-AMPL.1 80.01,18.92
N$42
  Bottom 0.75: POT-4-OFFSET.2 96.39,25.4 94.08,25.4 93.98,25.5
  Bottom 2: R17.2 96.39,25.4
N$43
  Bottom 0.508: 83.88,5.12 S3.1
  Bottom 0.75: S3.1 83.82,6.35 86.23,8.76 88.27,8.76 92.2,12.7 R17.1
  Bottom 2: 83.82,6.35 83.82,4.19 | R17.1 93.85,12.57
N$44
  Bottom 0.508: 91.38,16.75 R20.2
  Bottom 0.61: 83.82,27.05 83.82,24.13
  Bottom 0.75: S3.2 80.01,6.35 86.36,12.7 R19.2 88.9,13.97 R20.2 88.9,19.05 88.9,20.32 87.63,21.59 85.09,21.59 83.82,22.86 83.82,24.13 | IC3.2 80.01,26.16 80.01,27.18 81.03,28.19 83.06,28.19 83.82,27.43 83.82,27.05
  Bottom 2: 80.01,26.16 80.01,24.77 | 80.01,6.35 80.01,4.32 | 88.77,12.57 R19.2 | 91.44,16.64 R20.2
N$45
  Bottom 0.508: 56.5,5.88 R18.2
  Bottom 0.75: R18.2 56.64,5.97 75.31,5.97 S3.3
  Bottom 2: 56.26,5.97 56.64,5.97
N$46
  Bottom 0.75: 91.44,24.38 R21.2 88.9,29.21 83.82,29.21 82.55,30.48 82.55,32.64 IC3.6
  Bottom 2: 82.55,33.78 82.55,32.64 | R20.1 91.44,24.38 | R21.2 91.44,26.8
N$47
  Bottom 2: J5.1 R21.1
N$48
  Bottom 0.75: 54.61,52.07 R22---.1
  Bottom 2: 54.61,52.07 IC2.16 R22---.1
N$49
  Bottom 0.75: 55.88,59.69 56.02,59.69 56.53,59.18 56.53,59.07 56.52,59.05 56.52,55.63 57.15,54.99 57.15,52.07
  Bottom 2: IC2.15 57.15,52.07 | R22---.3 55.88,59.69
N$50
  Bottom 2: 52.58,20.83 52.58,19.18
N$51
  Bottom 2: 42.29,28.45 42.29,26.67
N$52
  Bottom 2: 39.75,28.32 39.75,26.67
N$53
  Bottom 2: 54.61,31.75 55.88,31.75
N$54
  Bottom 2: 58.04,28.7 57.66,28.7 57.53,28.57
N$55
  Bottom 2: 58.55,26.04 59.05,26.04
N$56
  Bottom 2: 59.94,23.24 60.07,23.37 60.83,23.37
N$57
  Bottom 2: 61.09,20.7 61.98,20.7
N$58
  Bottom 2: 71.12,20.7 70.23,20.7
N$59
  Bottom 2: 69.98,23.24 69.09,23.24
N$60
  Bottom 2: 68.58,26.16 67.82,26.16
N$61
  Bottom 2: 67.06,28.45 66.67,28.45
N$62
  Bottom 2: 64.77,31.62 64.39,31.62
N$63
  Bottom 2: 77.47,26.04 77.47,24.77
N$64
  Bottom 2: 82.3,26.16 82.3,24.89
N$65
  Bottom 2: 85.34,26.29 85.34,24.89
N$66
  Bottom 2: 77.47,33.91 77.47,32.64
N$67
  Bottom 2: 85.09,33.78 85.09,32.51
N$68
  Bottom 2: 76.2,5.71 76.2,4.32
N$69
  Bottom 2: 89.03,24.51 88.9,24.38 88.9,24.26
N$70
  Bottom 2: 89.03,34.29 89.03,34.16
N$71
  Bottom 2: 86.36,49.53 86.36,47.88
N$72
  Bottom 2: 93.98,56.64 93.98,55.5
N$73
  Bottom 2: 86.36,56.64 86.36,55.5
N$74
  Bottom 2: 81.28,64.77 81.28,64.39
N$75
  Bottom 2: 78.74,53.34 78.87,53.34
N$76
  Bottom 2: 34.8,52.7 34.92,52.58
N$77
  Bottom 2: 57.28,43.18 57.28,43.43
N$78
  Bottom 2: 39.37,5.08 39.5,5.08
N$79
  Bottom 2: 29.59,7.49 29.97,7.49
N$80
  Bottom 2: 21.46,7.37 21.72,7.37
N$81
  Bottom 2: 19.68,15.11 21.34,15.11
N$82
  Bottom 2: 19.68,17.78 21.21,17.78
N$83
  Bottom 2: 19.05,20.32 20.95,20.32
N$84
  Bottom 2: 15.11,25.27 15.62,25.27
N$85
  Bottom 2: 38.99,41.78 38.86,41.66
N$86
  Bottom 2: 25.4,43.05 25.53,43.05
N$87
  Bottom 2: 24.26,60.71 24.38,60.58
N$88
  Bottom 2: 16.26,57.53 16.38,57.53
N$90
  Bottom 2: 14.1,60.71 14.22,60.71
N$91
  Bottom 2: 8.76,24.89 8.89,25.02 8.89,25.27
N$92
  Bottom 2: 36.2,47.24 36.07,47.12 35.94,47.12
N$93
  Bottom 2: 19.05,39.37 21.08,39.37
N$94
  Bottom 2: 18.92,34.29 20.95,34.29
(copper drawn outside any net)
  shapes: Bottom area x11

### Text on the board
Top: Side Up
Bottom: Side Up